# Altium schematic sheet TopSheet.SchDoc
size A4; DocumentNumber: 1; SheetNumber: 1; SheetTotal: 4
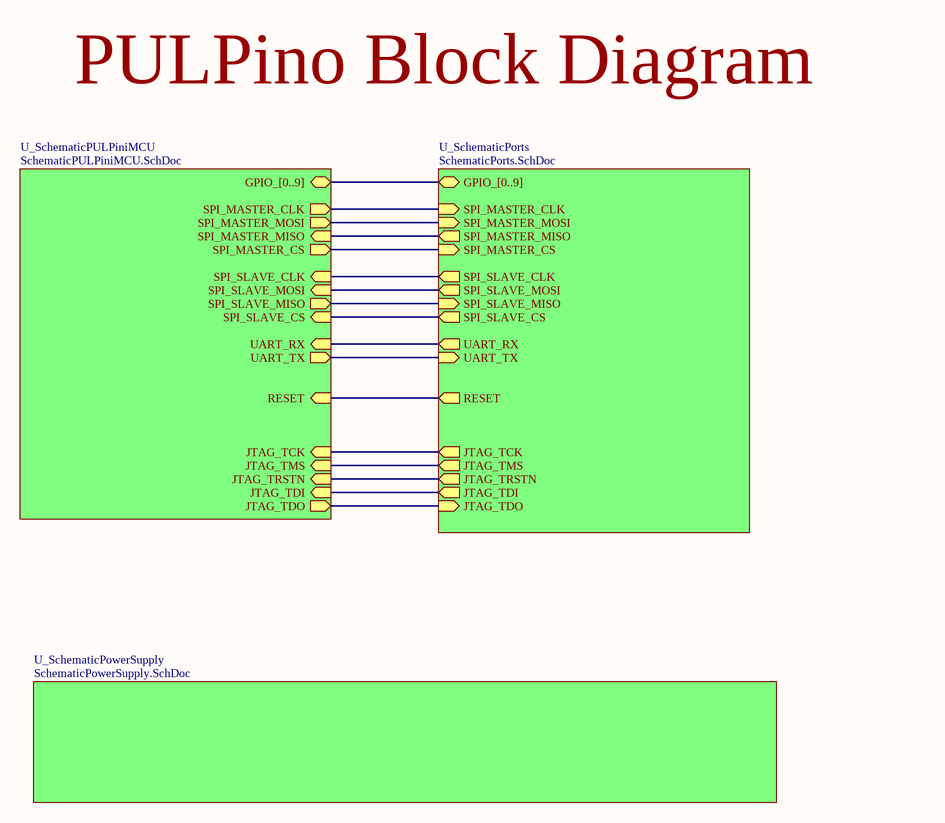
[diagram p0: TopSheet.SchDoc]

## Sub-sheets
U_SchematicPorts = SchematicPorts.SchDoc: JTAG_TCK (out), JTAG_TRSTN (out), JTAG_TMS (out), JTAG_TDI (out), JTAG_TDO (in), UART_TX (in), UART_RX (out), SPI_MASTER_CS (in), SPI_MASTER_CLK (in), SPI_MASTER_MISO (out), SPI_MASTER_MOSI (in), SPI_SLAVE_CLK (out), SPI_SLAVE_CS (out), SPI_SLAVE_MISO (in), SPI_SLAVE_MOSI (out), GPIO_[0..9] (bidir), RESET (out)
U_SchematicPowerSupply = SchematicPowerSupply.SchDoc: no entries
U_SchematicPULPiniMCU = SchematicPULPiniMCU.SchDoc: SPI_SLAVE_CLK (in), SPI_SLAVE_CS (in), SPI_SLAVE_MISO (out), SPI_SLAVE_MOSI (in), SPI_MASTER_CS (out), SPI_MASTER_CLK (out), SPI_MASTER_MISO (in), SPI_MASTER_MOSI (out), UART_TX (out), UART_RX (in), JTAG_TCK (in), JTAG_TRSTN (in), JTAG_TMS (in), JTAG_TDI (in), JTAG_TDO (out), GPIO_[0..9] (bidir), RESET (in)

## Nets
(unnamed): sheet U_SchematicPorts/JTAG_TCK, sheet U_SchematicPULPiniMCU/JTAG_TCK
(unnamed): sheet U_SchematicPorts/JTAG_TRSTN, sheet U_SchematicPULPiniMCU/JTAG_TRSTN
(unnamed): sheet U_SchematicPorts/JTAG_TMS, sheet U_SchematicPULPiniMCU/JTAG_TMS
(unnamed): sheet U_SchematicPorts/JTAG_TDI, sheet U_SchematicPULPiniMCU/JTAG_TDI
(unnamed): sheet U_SchematicPorts/JTAG_TDO, sheet U_SchematicPULPiniMCU/JTAG_TDO
(unnamed): sheet U_SchematicPorts/UART_TX, sheet U_SchematicPULPiniMCU/UART_TX
(unnamed): sheet U_SchematicPorts/UART_RX, sheet U_SchematicPULPiniMCU/UART_RX
(unnamed): sheet U_SchematicPorts/SPI_MASTER_CS, sheet U_SchematicPULPiniMCU/SPI_MASTER_CS
(unnamed): sheet U_SchematicPorts/SPI_MASTER_CLK, sheet U_SchematicPULPiniMCU/SPI_MASTER_CLK
(unnamed): sheet U_SchematicPorts/SPI_MASTER_MISO, sheet U_SchematicPULPiniMCU/SPI_MASTER_MISO
(unnamed): sheet U_SchematicPorts/SPI_MASTER_MOSI, sheet U_SchematicPULPiniMCU/SPI_MASTER_MOSI
(unnamed): sheet U_SchematicPorts/SPI_SLAVE_CLK, sheet U_SchematicPULPiniMCU/SPI_SLAVE_CLK
(unnamed): sheet U_SchematicPorts/SPI_SLAVE_CS, sheet U_SchematicPULPiniMCU/SPI_SLAVE_CS
(unnamed): sheet U_SchematicPorts/SPI_SLAVE_MISO, sheet U_SchematicPULPiniMCU/SPI_SLAVE_MISO
(unnamed): sheet U_SchematicPorts/SPI_SLAVE_MOSI, sheet U_SchematicPULPiniMCU/SPI_SLAVE_MOSI
(unnamed): sheet U_SchematicPorts/RESET, sheet U_SchematicPULPiniMCU/RESET

## Buses and harness runs
bus sheet U_SchematicPorts/GPIO_[0..9] = sheet U_SchematicPULPiniMCU/GPIO_[0..9]

## Notes on the sheet
- PULPino Block Diagram